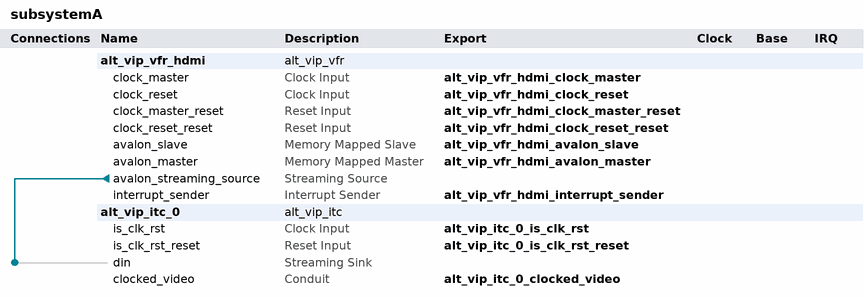
[diagram p0: system contents]
# Platform Designer (Qsys) system subsystemA, Cyclone V 5CSEBA6U23I7
# Parameters at their usual value, and those the tool derives, are not listed.
package require qsys
create_system subsystemA
set_project_property DEVICE_FAMILY {Cyclone V}
set_project_property DEVICE 5CSEBA6U23I7

add_instance alt_vip_vfr_hdmi alt_vip_vfr 14.0
set_instance_parameter_value alt_vip_vfr_hdmi MAX_IMAGE_WIDTH 1024

add_instance alt_vip_itc_0 alt_vip_itc 14.0
set_instance_parameter_value alt_vip_itc_0 FIFO_DEPTH 1920
set_instance_parameter_value alt_vip_itc_0 H_ACTIVE_PIXELS 1024
set_instance_parameter_value alt_vip_itc_0 H_BACK_PORCH 160
set_instance_parameter_value alt_vip_itc_0 H_FRONT_PORCH 24
set_instance_parameter_value alt_vip_itc_0 H_SYNC_LENGTH 136
set_instance_parameter_value alt_vip_itc_0 NUMBER_OF_COLOUR_PLANES 4
set_instance_parameter_value alt_vip_itc_0 THRESHOLD 1919
set_instance_parameter_value alt_vip_itc_0 V_ACTIVE_LINES 768
set_instance_parameter_value alt_vip_itc_0 V_BACK_PORCH 29
set_instance_parameter_value alt_vip_itc_0 V_FRONT_PORCH 3
set_instance_parameter_value alt_vip_itc_0 V_SYNC_LENGTH 6

# connections
add_connection alt_vip_vfr_hdmi.avalon_streaming_source alt_vip_itc_0.din avalon_streaming

# exported interfaces
add_interface alt_vip_itc_0_clocked_video conduit end
set_interface_property alt_vip_itc_0_clocked_video EXPORT_OF alt_vip_itc_0.clocked_video
add_interface alt_vip_itc_0_is_clk_rst clock sink
set_interface_property alt_vip_itc_0_is_clk_rst EXPORT_OF alt_vip_itc_0.is_clk_rst
add_interface alt_vip_itc_0_is_clk_rst_reset reset sink
set_interface_property alt_vip_itc_0_is_clk_rst_reset EXPORT_OF alt_vip_itc_0.is_clk_rst_reset
add_interface alt_vip_vfr_hdmi_avalon_master avalon master
set_interface_property alt_vip_vfr_hdmi_avalon_master EXPORT_OF alt_vip_vfr_hdmi.avalon_master
add_interface alt_vip_vfr_hdmi_avalon_slave avalon slave
set_interface_property alt_vip_vfr_hdmi_avalon_slave EXPORT_OF alt_vip_vfr_hdmi.avalon_slave
add_interface alt_vip_vfr_hdmi_clock_master clock sink
set_interface_property alt_vip_vfr_hdmi_clock_master EXPORT_OF alt_vip_vfr_hdmi.clock_master
add_interface alt_vip_vfr_hdmi_clock_master_reset reset sink
set_interface_property alt_vip_vfr_hdmi_clock_master_reset EXPORT_OF alt_vip_vfr_hdmi.clock_master_reset
add_interface alt_vip_vfr_hdmi_clock_reset clock sink
set_interface_property alt_vip_vfr_hdmi_clock_reset EXPORT_OF alt_vip_vfr_hdmi.clock_reset
add_interface alt_vip_vfr_hdmi_clock_reset_reset reset sink
set_interface_property alt_vip_vfr_hdmi_clock_reset_reset EXPORT_OF alt_vip_vfr_hdmi.clock_reset_reset
add_interface alt_vip_vfr_hdmi_interrupt_sender interrupt sender
set_interface_property alt_vip_vfr_hdmi_interrupt_sender EXPORT_OF alt_vip_vfr_hdmi.interrupt_sender

set_interconnect_requirement {$system} qsys_mm.clockCrossingAdapter HANDSHAKE
set_interconnect_requirement {$system} qsys_mm.enableEccProtection FALSE
set_interconnect_requirement {$system} qsys_mm.insertDefaultSlave FALSE
set_interconnect_requirement {$system} qsys_mm.maxAdditionalLatency 1

save_system subsystemA.qsys
